# EAGLE design vmuzero_keyonly (EAGLE 6.6.0)
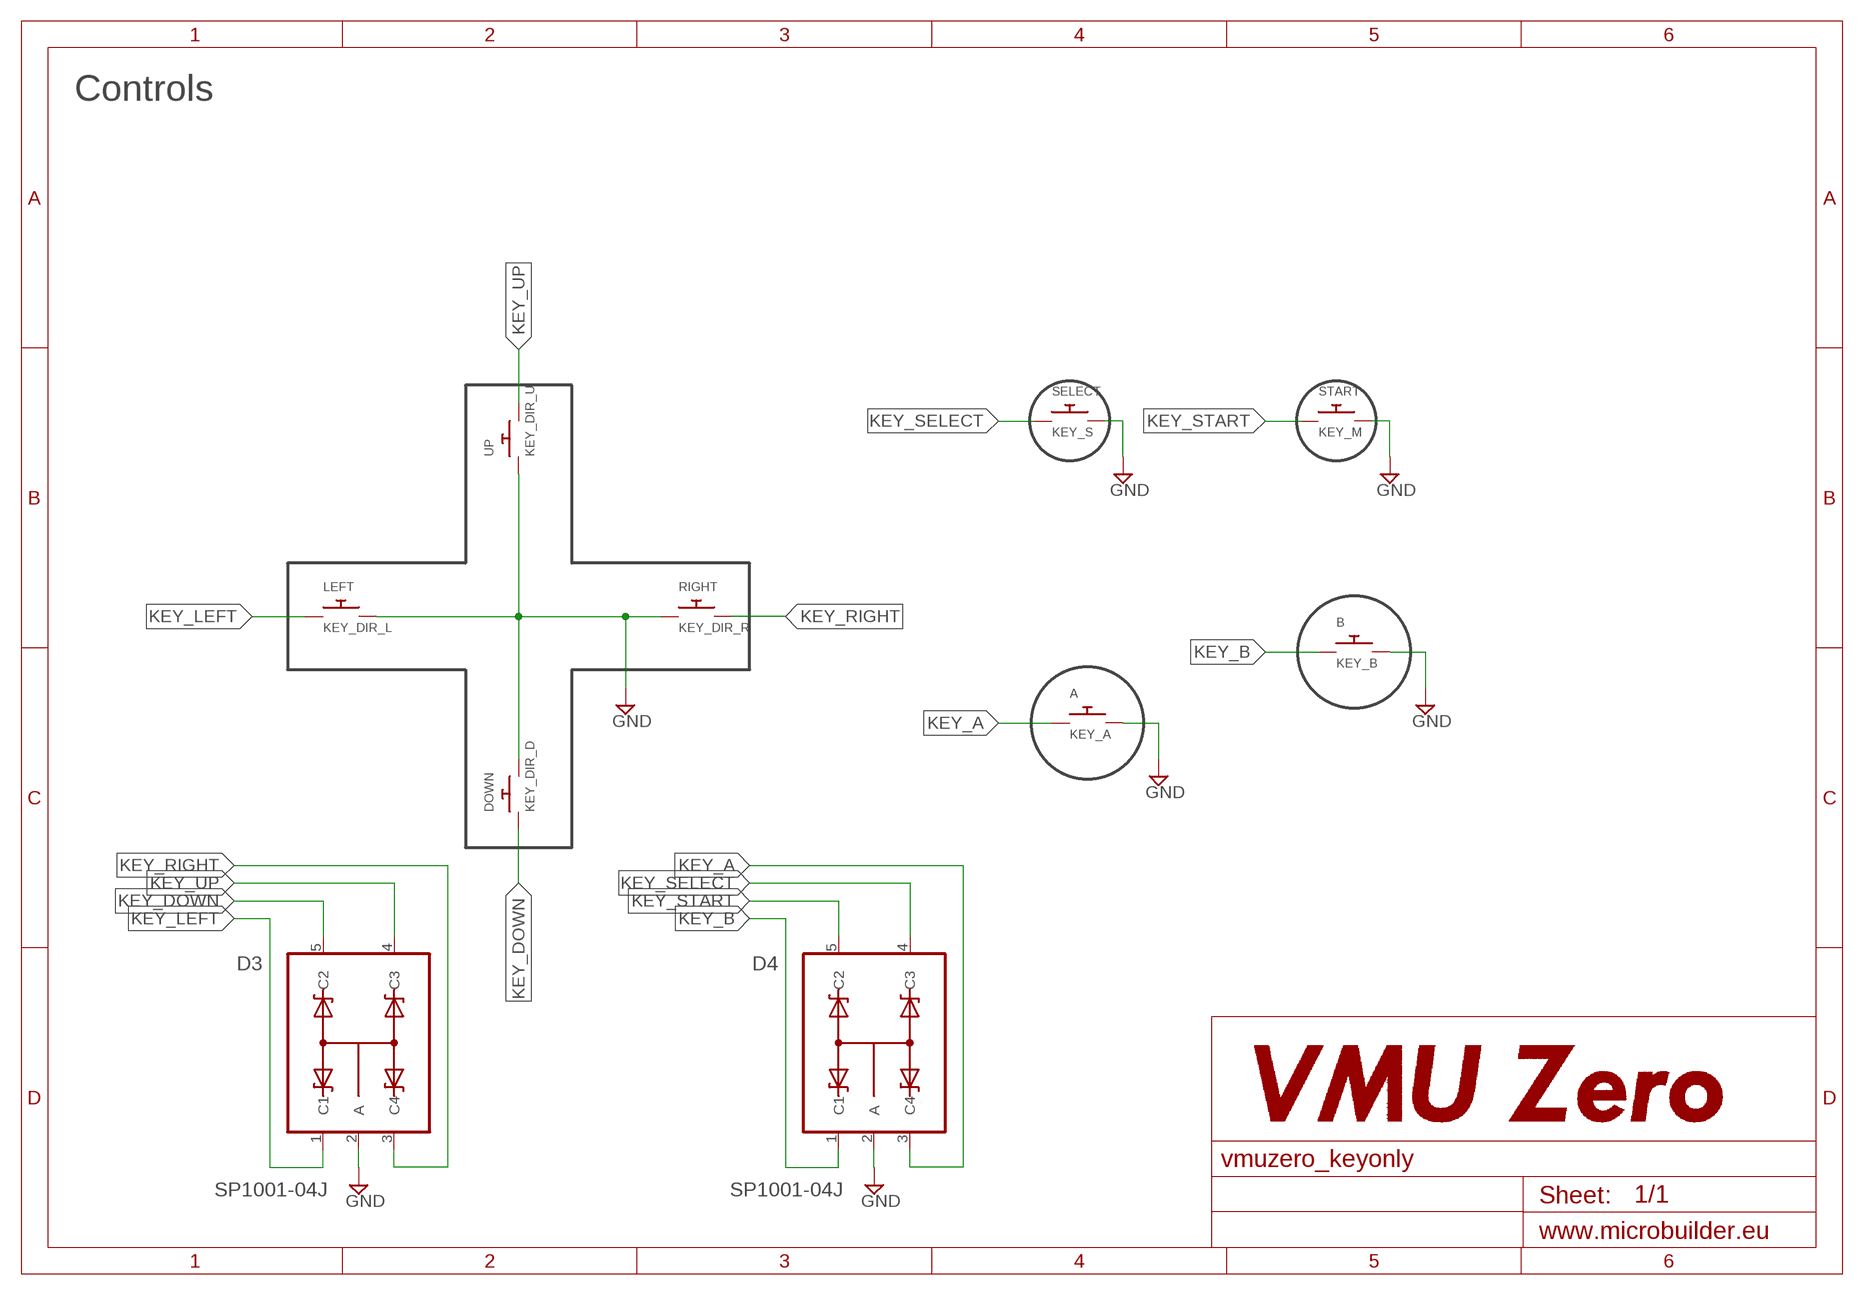
[diagram p0: schematic, sheet 1]

## Parts
A  KEY_A  SWITCH_PUSH_VMU  [KEYPAD_VMU_R26]
B  KEY_B  SWITCH_PUSH_VMU  [KEYPAD_VMU_R26]
D3  SP1001-04J  [SC70-5]
D4  SP1001-04J  [SC70-5]
DOWN  KEY_DIR_D  SWITCH_PUSH_VMU  [KEYPAD_VMU_R26]
LEFT  KEY_DIR_L  SWITCH_PUSH_VMU  [KEYPAD_VMU_R26]
RIGHT  KEY_DIR_R  SWITCH_PUSH_VMU  [KEYPAD_VMU_R26]
SELECT  KEY_S  SWITCH_PUSH_VMU  [KEYPAD_VMU_R26]
START  KEY_M  SWITCH_PUSH_VMU  [KEYPAD_VMU_R26]
UP  KEY_DIR_U  SWITCH_PUSH_VMU  [KEYPAD_VMU_R26]

## Nets
GND: A.2 B.2 D3.2(A) D4.2(A) DOWN.2 LEFT.2 RIGHT.1 SELECT.2 START.2 UP.1
KEY_A: A.1 D4.3(C4)
KEY_B: B.1 D4.1(C1)
KEY_DOWN: D3.5(C2) DOWN.1
KEY_LEFT: D3.1(C1) LEFT.1
KEY_RIGHT: D3.3(C4) RIGHT.2
KEY_SELECT: D4.4(C3) SELECT.1
KEY_START: D4.5(C2) START.1
KEY_UP: D3.4(C3) UP.2

## Notes on the sheet
- Controls

## Library data of the parts
A B DOWN LEFT RIGHT SELECT START UP = vmuzero:SWITCH_PUSH_VMU: Buttons SWITCH_PUSH_VMU - Soft touch temporary push button for VMU
D3 D4 = vmuzero:SP1001-04: SP1001 Series - 8pF 15kV Unidirectional TVS Array; DIGIKEY: F2895CT-ND; MPN: SP1001-04; PACKAGE: SC70-5; SUPPLIER: Littelfuse

## Board
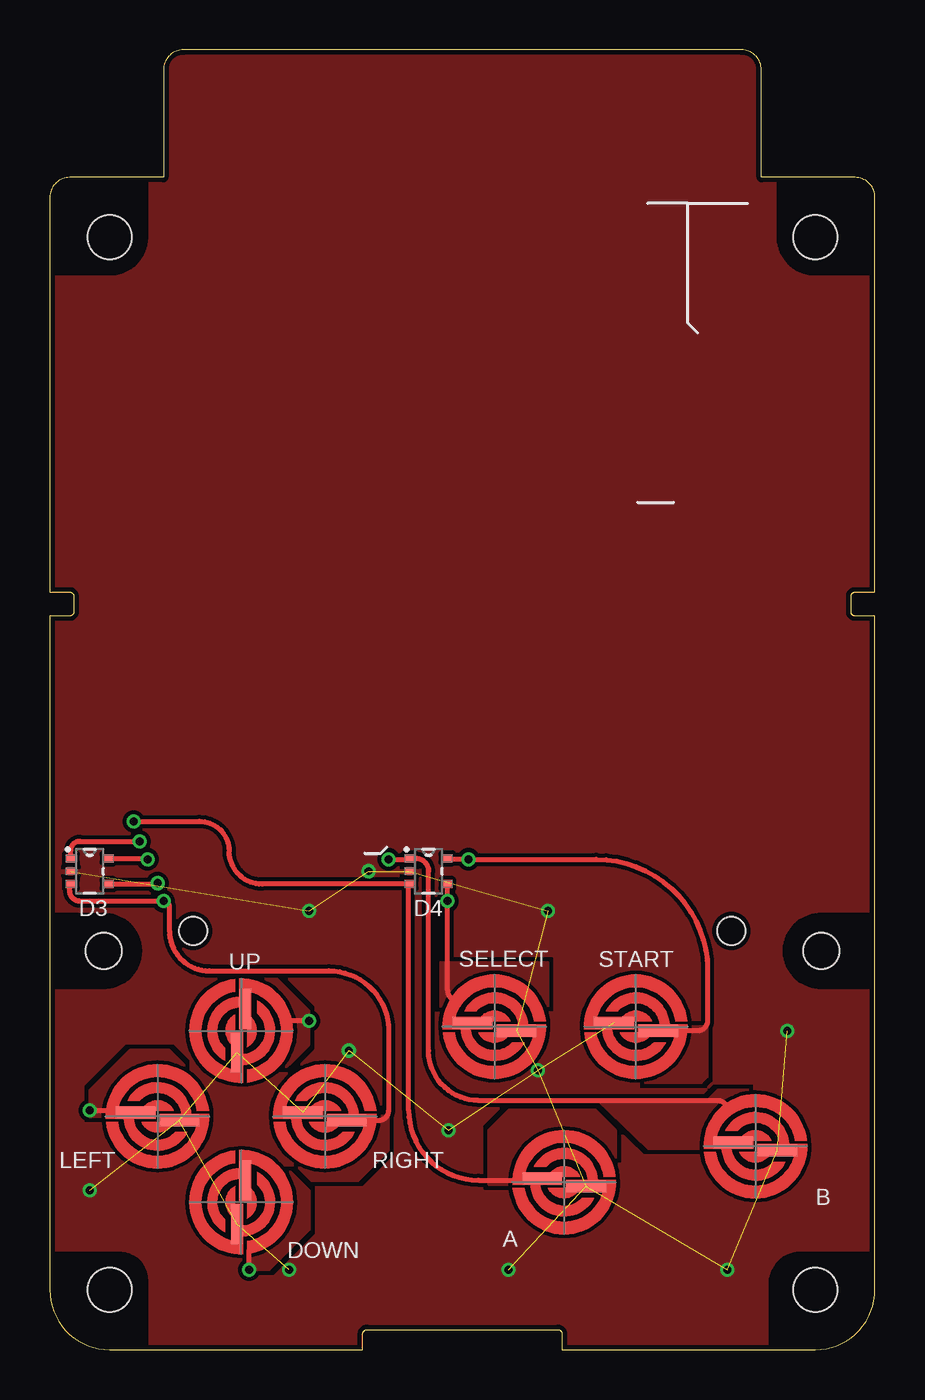
[diagram p1: board, top side]
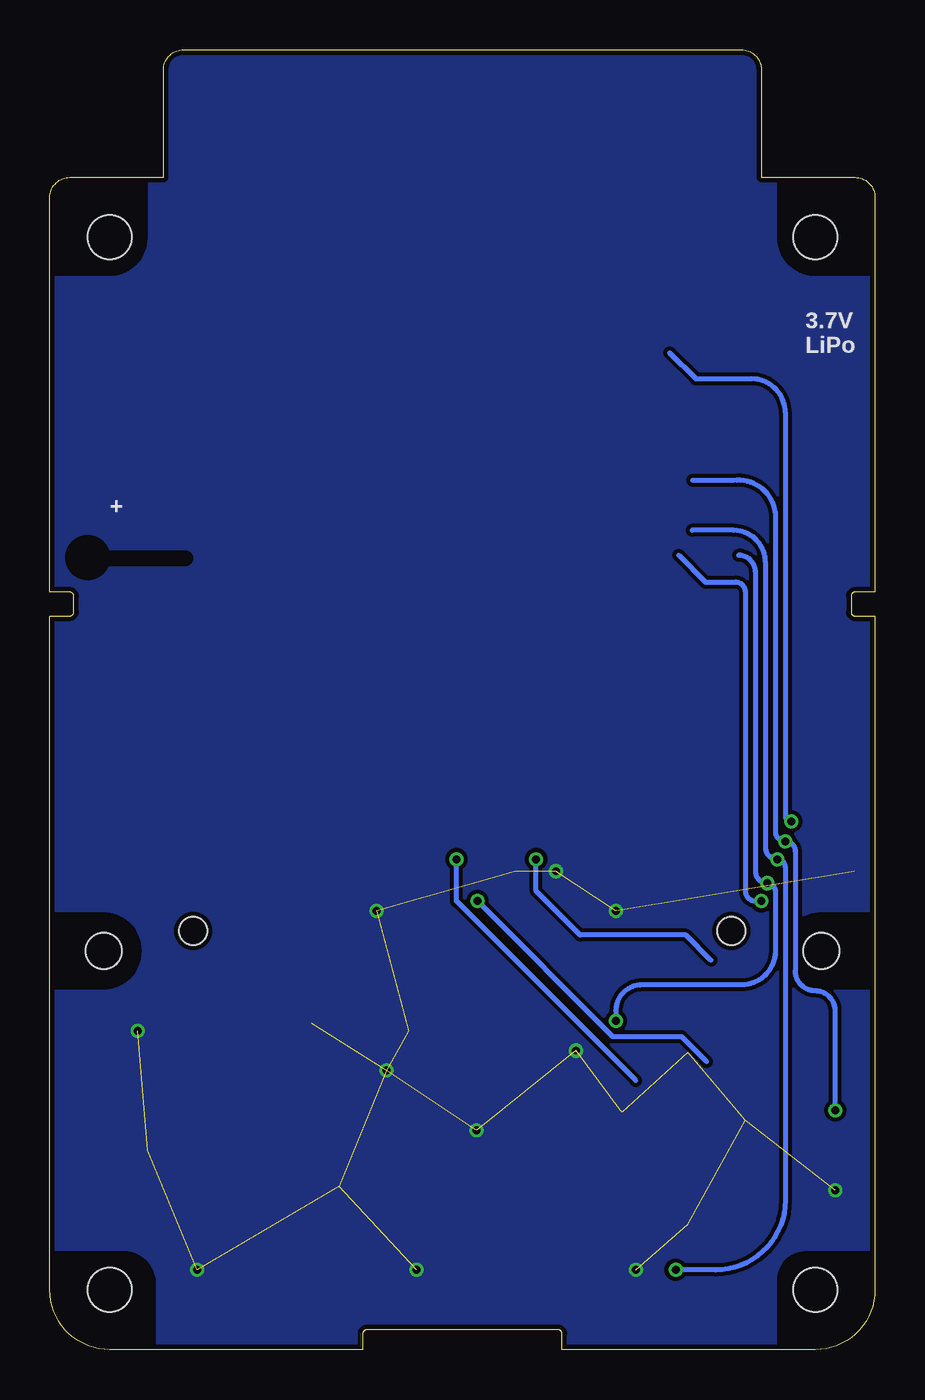
[diagram p2: board, bottom side, seen from below]

Size 41.4 x 65.2 mm. Coordinates in mm from the lower left corner, seen from the top.
Outline: 3,0 15.7,0 15.7,0.8 arc-90 15.9,1 25.5,1 arc-90 25.7,0.8 25.7,0 38.4,0 arc90 41.4,3 41.4,36.8 40.4,36.8 arc-90 40.2,37 40.2,37.8 arc-90 40.4,38 41.4,38 41.4,57.8 arc90 40.4,58.8 35.7,58.8 35.7,64.2 arc90 34.7,65.2 6.7,65.2 arc90 5.7,64.2 5.7,58.8 1,58.8 arc90 0,57.8 0,38 1,38 arc-90 1.2,37.8 1.2,37 arc-90 1,36.8 0,36.8 0,3 arc90 3,0
Copper layers (1*16): Top 0.035mm / dielectric 1.5mm / Bottom 0.035mm
Design rules "SeeedStudio_2layer_DRU_no_angle_20140221 *": minimum track width 6mil, minimum drill 12mil, track to track 6mil, track to pad 6mil, pad to pad 6mil, via to via 6mil, smd to smd 0mil, copper to edge 10mil, drill to drill 12mil, minimum pad ring 10mil, minimum via ring 6mil, stop-mask expansion 2mil, vias tented up to drill 100mil, thermal gap 10mil
Holes 2.2 mm at 3,3 38.4,3 3,55.8 38.4,55.8
Holes 1.8 mm at 2.7,20 38.7,20
Holes 1.4 mm at 7.2,21 34.2,21
tKeepout: area 0,20 to 41.4,22
bRestrict: area 38.7,38.9 to 40.3,40.5; 1 lines

### Footprints (pad centres in the part's own frame; a part is rotated, then mirrored left to right if it is on the bottom)
KEYPAD_VMU_R26 = smd 0.6 x 2: 1 -0.2,-1.1; 2 0.2,1.1
SC70-5 = smd 0.5 x 0.4: 1 -0.95,0.65; 2 -0.95,0; 3 -0.95,-0.65; 4 0.95,-0.65; 5 0.95,0.65

### Placement (x,y rotation side)
A  25.8,8.4 270 top
B  35.4,10.2 270 top
D3  2,24 0 top
D4  19,24 0 top
DOWN  9.6,7.4 180 top
LEFT  5.4,11.7 270 top
RIGHT  13.8,11.7 270 top
SELECT  22.3,16.2 270 top
START  29.4,16.2 90 top
UP  9.6,16 0 top

### Tracks (layer width: path | path; a pad name or v marks a point on that pad's centre or on a via)
GND  (via drill 0.4)  (20 unrouted)
  other vias: 23,4 34,4 12,4 16,24 37,16 25,22 13,22 2,8 15,15 20,11 24.5,14
  pour Top (isolate 0.203, rank 6): 0,5 3.5,5 arc-90 5,3.5 5,0 36,0 36,3.5 arc-90 37.9,5 41.4,5 41.4,18 38.7,18 arc-90 36.7,20 arc-90 38.7,22 41.4,22 41.4,53.8 38.4,53.8 arc-90 36.4,55.8 36.4,65.2 5,65.2 5,55.8 arc-90 3,53.8 0,53.8 0,22 2.7,22 arc-90 4.7,20 arc-90 2.7,18 0,18
  pour Bottom (isolate 0.203, rank 6): 0,5 3.5,5 arc-90 5,3.5 5,0 36,0 36,3.5 arc-90 37.9,5 41.4,5 41.4,18 38.7,18 arc-90 36.7,20 arc-90 38.7,22 41.4,22 41.4,53.8 38.4,53.8 arc-90 36.4,55.8 36.4,65.2 5,65.2 5,55.8 arc-90 3,53.8 0,53.8 0,22 2.7,22 arc-90 4.7,20 arc-90 2.7,18 0,18
  pour Top (rank 6, no thermals): 5.5,3 5.5,1.25 35.5,1.25 35.5,3
KEY_A  (via drill 0.4)
  Top 0.254: v4.2,26.5 7.5,26.5 arc-90 9,25 arc90 10.65,23.35 D4.3 18,23.3 18,12 arc90 21.5,8.5 24.6,8.5 | 24.6,8.5 A.1 arc-90 24.6,8.5
  Bottom 0.254: 10.31,50.01 9,48.7 6.2,48.7 arc90 4.5,47 4.5,26.8 arc-90 v4.2,26.5
  pour Top (isolate 0.203): 22,8.3 28.4,8.3 28.4,11 27.4,12 23,12 22,11
KEY_B  (via drill 0.4)
  Top 0.254: v17,24.6 18,24.6 D4.1 18.35,24.65 arc-90 19,24 19,15 arc90 21.5,12.5 33.5,12.5 arc-90 34,12 33,10.5 B.1
  Bottom 0.254: 8.23,19.53 9.5,20.8 14.8,20.8 17,23 v17,24.6
  pour Top (isolate 0.203, no thermals): 30,10.1 38.1,10.1 38.1,12.6 37.7,13 33.5,13 33,12.5 27.5,12.5
KEY_DOWN  (via drill 0.4)
  Top 0.254: v10,4 10,5 11,5.5 11.5,6 12,7 12,8 10.5,9.5 10,9.5 DOWN.1 | D3.5 4.85,24.65 v4.9,24.6
  Bottom 0.254: 9.18,41.1 7.1,41.1 arc90 5.5,39.5 5.5,25.2 arc-90 v4.9,24.6 arc90 4.5,24.2 4.5,7.5 arc90 8,4 v10,4
  pour Top (isolate 0.203): 10,4 10,10.3 10.7,10.3 13,8 13,6 11,4
KEY_LEFT  (via drill 0.4)
  Top 0.254: v2,12 4.2,12 LEFT.1 | D3.1 1.05,25.05 arc-90 1.5,25.5 v4.5,25.5
  Bottom 0.254: 9.14,43.6 7.1,43.6 arc90 5,42 5,26 arc-90 v4.5,25.5 arc90 4,25 4,19 arc-90 3,18 arc90 2,17 v2,12
  pour Top (isolate 0.203): 2,11.7 8,11.7 8,12.9 8,13 6,15 4,15 2,13
KEY_RIGHT  (via drill 0.4)
  Top 0.254: D3.3 arc90 1,23.3 1,23 arc90 1.5,22.5 v5.7,22.5 arc-90 6,22.2 6,21 arc90 8,19 14,19 arc-90 17,16 17,12 arc-90 16.5,11.5 RIGHT.2
  Bottom 0.254: 9.85,39.85 8.5,38.5 7,38.5 arc90 6.5,38 6.5,23 arc-90 6,22.5 v5.7,22.5
  pour Top (isolate 0.203): 17,11.7 11.2,11.7 11.2,10.4 13.1,8.5 15.5,8.5 17,10
KEY_SELECT  (via drill 0.4)
  Top 0.254: D4.4 v19.95,22.5 19.95,18.05 arc90 20.5,17.5 20,17 20,16.5 20.1,16.4 SELECT.1
  Bottom 0.254: 8.45,14.45 9.7,15.7 13.15,15.7 v19.95,22.5
  pour Top (isolate 0.203, no thermals): 19.6,16.1 25,16.1 25,19.4 19.6,19.4
KEY_START  (via drill 0.4)
  Top 0.254: D4.5 20,24.6 v21,24.6 27.4,24.6 arc-90 33,19 33,16.5 arc-90 32.5,16 START.1
  Bottom 0.254: 12,13.5 21,22.5 v21,24.6
  pour Top (isolate 0.203): 33,16.2 26,16.2 26,13.8 26.4,13.4 32.7,13.4 33,13.7
KEY_UP  (via drill 0.4)
  Top 0.254: D3.4 5.35,23.35 v5.4,23.4 | v13,16.5 12,16.5 11.5,17 11.5,17.5 11,18 10.5,18.3 10,18.3 UP.2
  Bottom 0.254: v13,16.5 13,17 arc90 11.7,18.3 6.7,18.3 arc-90 5,20 5,23 arc-90 v5.4,23.4 arc90 6,24 6,39 arc-90 6.85,39.85
  pour Top (isolate 0.203, no thermals): 9.6,18.7 9.6,13.3 11,13.3 13,15.3 13,17 11.3,18.7

### Text on the board
bPlace: 3.7V / LiPo | +
tRestrict: VMU Key V1.0 | hemkop11@gmail.com
Measures: All dimensions in mm